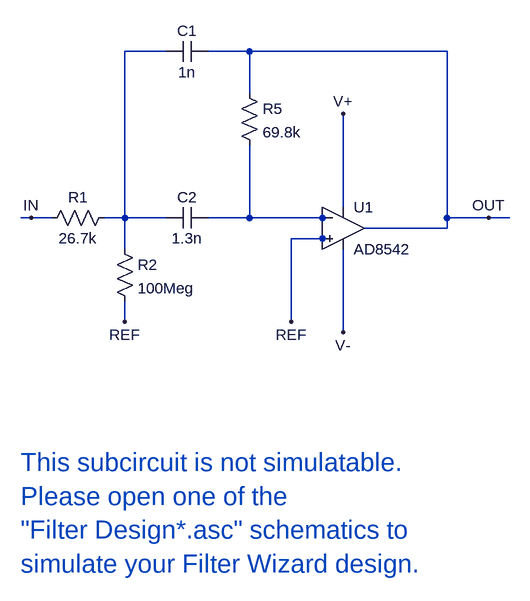
[diagram p0: schematic StageE_BandPassDeliyannisFriendNoPosFB_AD8542.asc]
StageE_BandPassDeliyannisFriendNoPosFB_AD8542.asc, the LTspice schematic file:
Version 4.1
SHEET 1 4112 860
WIRE 48 -128 -16 -128
WIRE 176 -128 112 -128
WIRE 480 -128 176 -128
WIRE 176 -64 176 -128
WIRE 320 112 320 -32
WIRE -160 128 -176 128
WIRE -128 128 -160 128
WIRE -16 128 -16 -128
WIRE -16 128 -48 128
WIRE 48 128 -16 128
WIRE 176 128 176 16
WIRE 176 128 112 128
WIRE 288 128 288 112
WIRE 288 128 176 128
WIRE 304 128 288 128
WIRE 480 128 480 -128
WIRE 544 128 480 128
WIRE 576 128 544 128
WIRE 480 144 352 144
WIRE 480 144 480 128
WIRE 288 160 240 160
WIRE 304 160 288 160
WIRE -16 176 -16 128
WIRE 288 176 288 160
WIRE 320 304 320 176
WIRE -16 288 -16 256
WIRE 240 288 240 160
FLAG 320 -32 V+
FLAG 320 304 V-
FLAG 544 128 OUT
FLAG -160 128 IN
FLAG 240 288 REF
FLAG -16 288 REF
SYMBOL res -32 112 R90
WINDOW 0 0 56 VBottom 2
WINDOW 3 32 56 VTop 2
SYMATTR InstName R1
SYMATTR Value 26.7k
SYMBOL cap 112 -144 R90
WINDOW 0 0 32 VBottom 2
WINDOW 3 32 32 VTop 2
SYMATTR InstName C1
SYMATTR Value 1n
SYMBOL res 160 -80 R0
SYMATTR InstName R5
SYMATTR Value 69.8k
SYMBOL cap 112 112 R90
WINDOW 0 0 32 VBottom 2
WINDOW 3 32 32 VTop 2
SYMATTR InstName C2
SYMATTR Value 1.3n
SYMBOL res -32 160 R0
SYMATTR InstName R2
SYMATTR Value 100Meg
SYMBOL Opamps\\AD8542 320 80 R0
SYMATTR InstName U1
TEXT -176 504 Left 4 ;This subcircuit is not simulatable.  \nPlease open one of the \n"Filter Design*.asc" schematics to \nsimulate your Filter Wizard design.

The netlist it stands for:
* StageE_BandPassDeliyannisFriendNoPosFB_AD8542.asc
R1 N001 IN 26.7k
C1 OUT N001 1n
R5 OUT N002 69.8k
C2 N002 N001 1.3n
R2 N001 REF 100Meg
X§U1 REF N002 V+ V- OUT AD8542  ; pins In+ In- V+ V- OUT
* This subcircuit is not simulatable.
* Please open one of the
* "Filter Design*.asc" schematics to
* simulate your Filter Wizard design.
.lib AD8542.sub
.backanno
.end